# Altium schematic sheet Buttons.SchDoc
size A
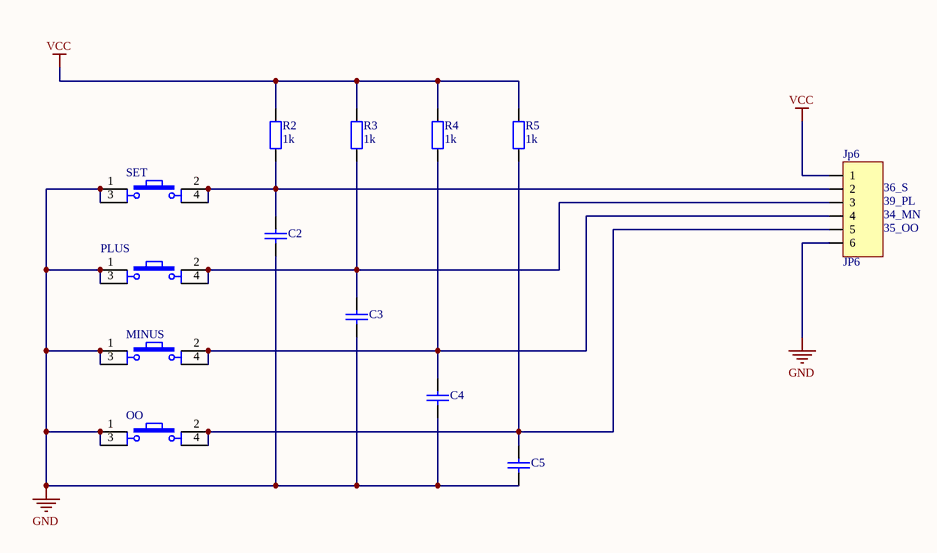
[diagram p0: Buttons.SchDoc]

## Parts
C2  Capacitor Ceramic  [C0805]  (value not drawn)
C3  Capacitor Ceramic  [C0805]  (value not drawn)
C4  Capacitor Ceramic  [C0805]  (value not drawn)
C5  Capacitor Ceramic  [C0805]  (value not drawn)
Jp6  JP6  [JP6-C1T]
MINUS  SW  [SW4]  (value not drawn)
OO  SW  [SW4]  (value not drawn)
PLUS  SW  [SW4]  (value not drawn)
R2  1k  [R1/4W]
R3  1k  [R1/4W]
R4  1k  [R1/4W]
R5  1k  [R1/4W]
SET  SW  [SW4]  (value not drawn)

## Nets
GND: C2.1 C3.1 C4.1 C5.1 Jp6.6 MINUS.1 MINUS.3 OO.1 OO.3 PLUS.1 PLUS.3 SET.1 SET.3
VCC: Jp6.1 R2.2 R3.2 R4.2 R5.2
NetC2_2: C2.2 Jp6.2 R2.1 SET.2 SET.4
NetC3_2: C3.2 Jp6.3 PLUS.2 PLUS.4 R3.1
NetC4_2: C4.2 Jp6.4 MINUS.2 MINUS.4 R4.1
NetC5_2: C5.2 Jp6.5 OO.2 OO.4 R5.1

## Notes on the sheet
- (near Jp6) 36_S
- (near Jp6) 39_PL
- (near Jp6) 34_MN
- (near Jp6) 35_OO

## Library data of the parts
C2-C5 = CapSMD: Capacitor; Value: 33p; Published: 8-Jun-2000; LatestRevisionDate: 17-Jul-2002; LatestRevisionNote: Re-released for DXP Platform.; PackageReference: RAD-0.3; Publisher: Altium Limited
Jp6 = JP6: WR-PHD 2.54 mm Angled Socket Header; Manufacturer: W¨¹rth Elektronik eiSos GmbH; partNo: 613006143121; ComponentLink1 Description: Manufacturer; ComponentLink2 Description: Datasheet; NoPins: 06; Created Date: 29 March 2013; ComponentLink1URL: http://www.we-online.com; ComponentLink2URL: http://katalog.we-online.de/em/datasheet/6130xx143121.pdf; Created by: Karrer Zheng
MINUS OO PLUS SET = SW4: Switch button 4 pin; Value: Button chip 4 pin
R2-R5 = R1/4W: Resistor 1/4W; Value: R1/4W - 1K